# Altium schematic sheet CAN_ESP.SchDoc
size A3; Revision: 7
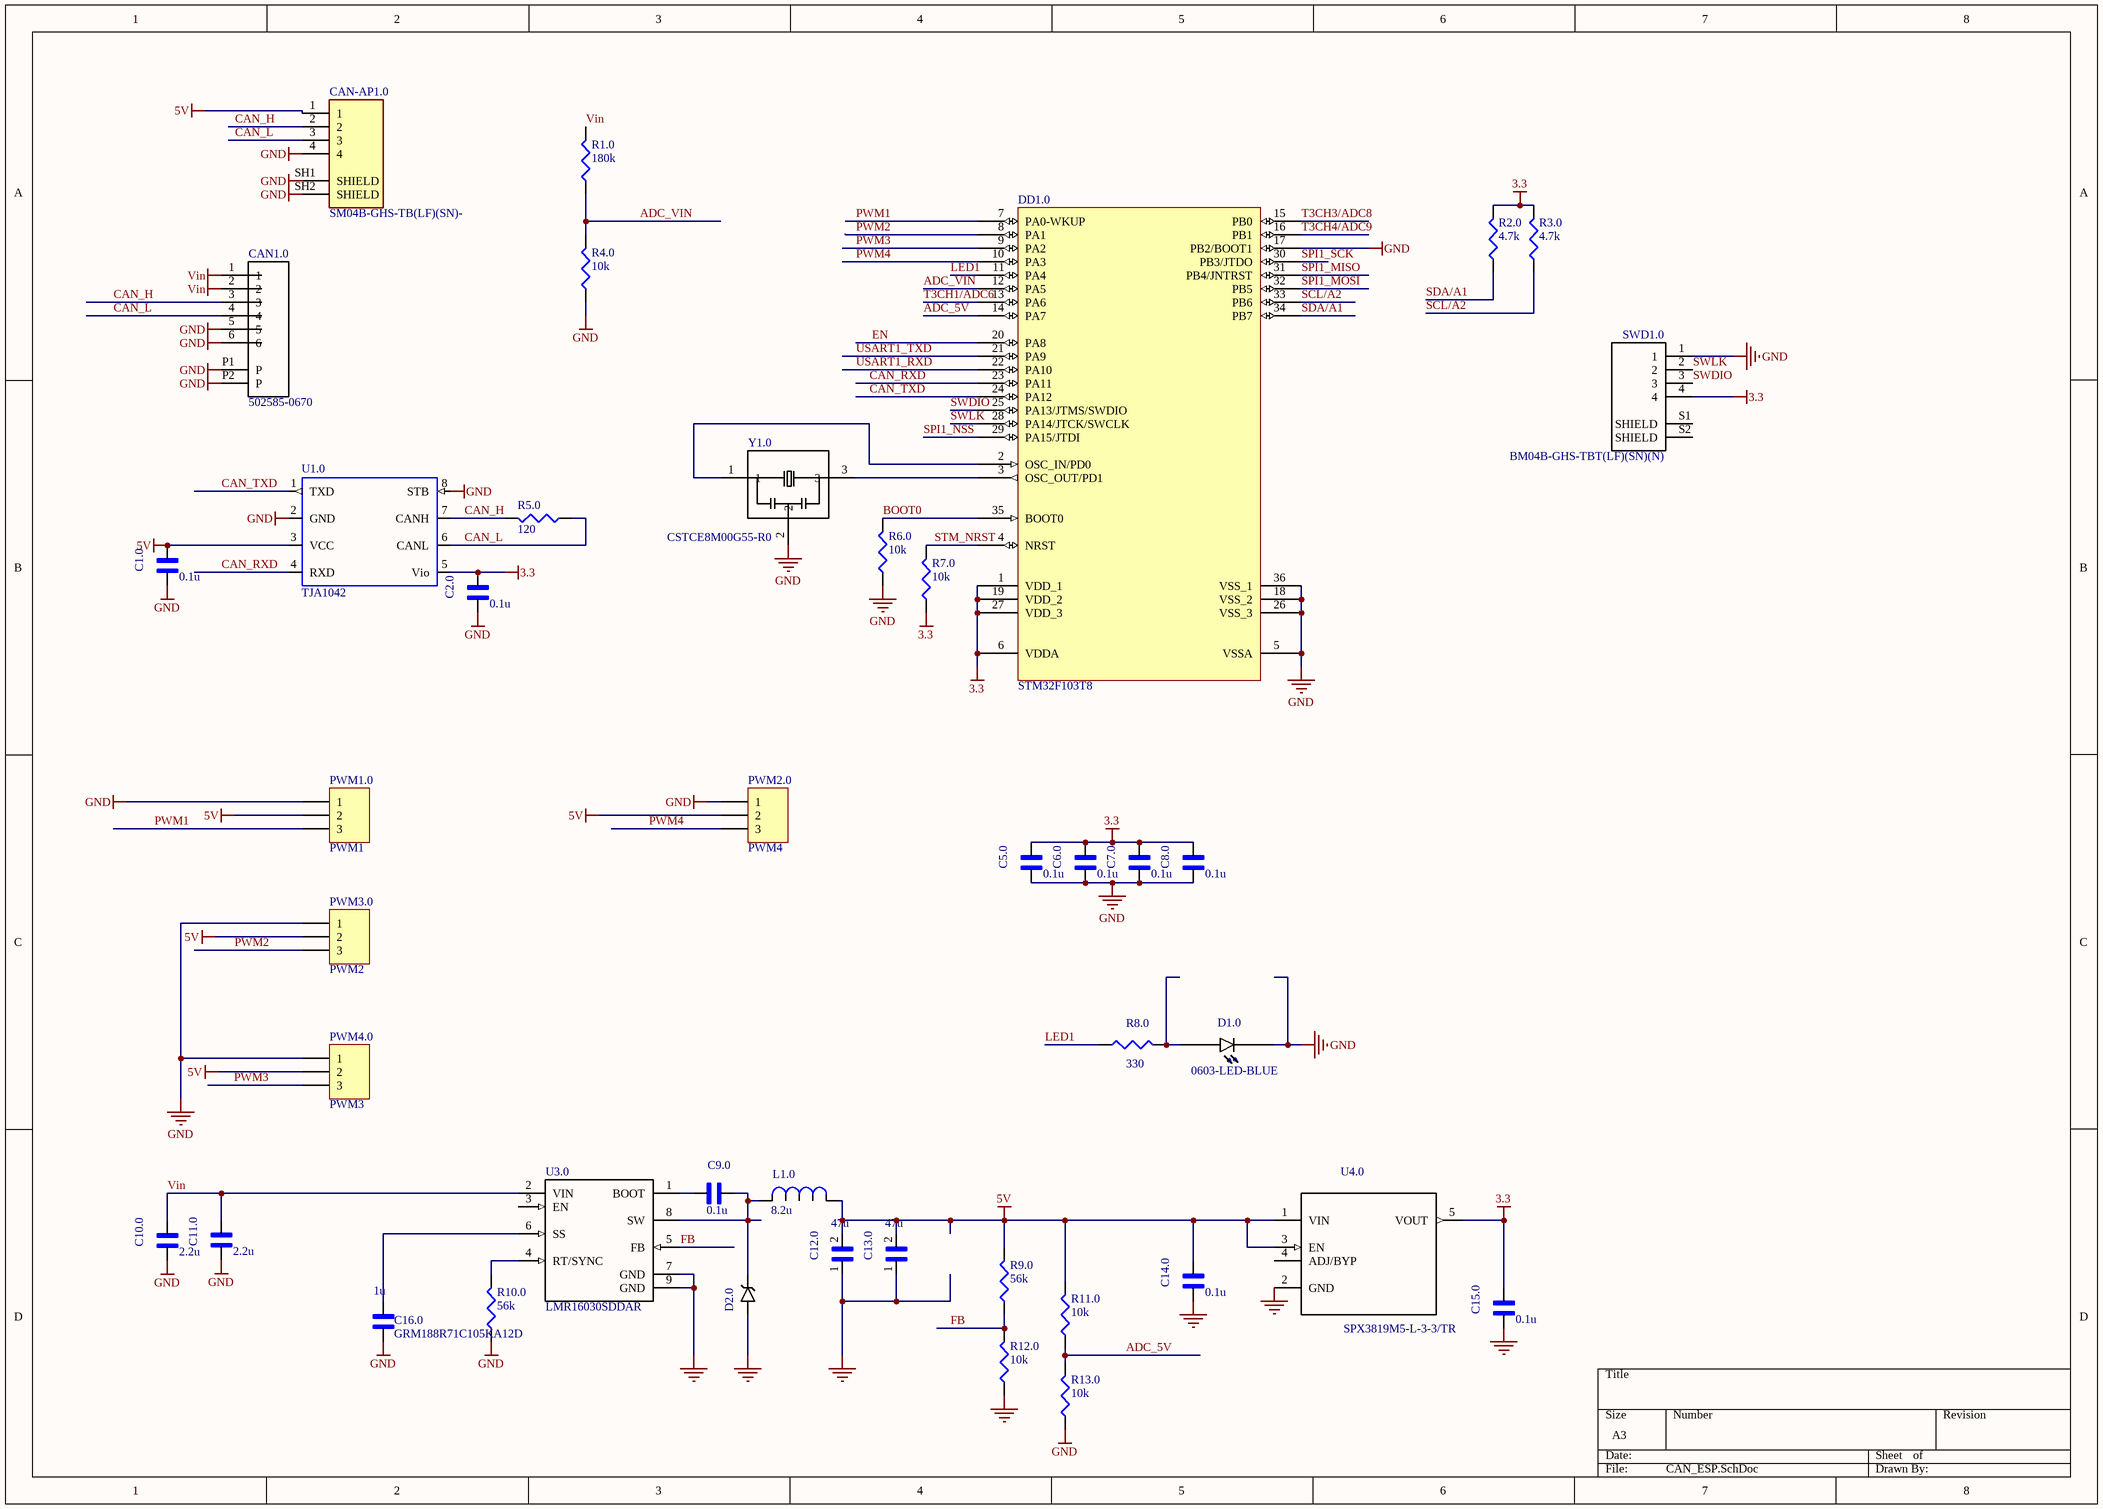
[diagram p0: CAN_ESP.SchDoc]

## Parts
C1.0  value 0.1u  [*CAPC1608X90]  (hidden comment: GX035C104MAT2-500)
C2.0  value 0.1u  [*CAPC1608X90]  (hidden comment: GX035C104MAT2-500)
C5.0  value 0.1u  [*CAPC1608X90]  (hidden comment: GX035C104MAT2-500)
C6.0  value 0.1u  [*CAPC1608X90]  (hidden comment: GX035C104MAT2-500)
C7.0  value 0.1u  [*CAPC1608X90]  (hidden comment: GX035C104MAT2-500)
C8.0  value 0.1u  [*CAPC1608X90]  (hidden comment: GX035C104MAT2-500)
C9.0  value 0.1u  [*CAPC1608X90]  (hidden comment: GX035C104MAT2-500)
C10.0  value 2.2u  [*CAP3216X125N]  (hidden comment: GRM31CR71H225KA88L)
C11.0  value 2.2u  [*CAP3216X125N]  (hidden comment: GRM31CR71H225KA88L)
C12.0  value 47u  [*CAPC3216X125N]  (hidden comment: GRM31CR61A476KE15L)
C13.0  value 47u  [*CAPC3216X125N]  (hidden comment: GRM31CR61A476KE15L)
C14.0  value 0.1u  [*CAPC1608X90]  (hidden comment: GX035C104MAT2-500)
C15.0  value 0.1u  [*CAPC1608X90]  (hidden comment: GX035C104MAT2-500)
C16.0  GRM188R71C105KA12D  value 1u  [CAPC1608X90N]
CAN1.0  502585-0670  [MOLEX_502585-0670]
CAN-AP1.0  SM04B-GHS-TB(LF)(SN)-  [JST_SM04B-GHS-TB(LF)(SN)-]
D1.0  0603-LED-BLUE  [*LEDM1608X80_LTE-C1906R-14(Primary)]
D2.0  SK56  [*SMB_P6SMB62AT3G(Primary)]  (value not drawn)
DD1.0  STM32F103T8  [*QFN50P600X600X100-37N]
L1.0  value 8.2u  [*IND_IHLP_2525_CZ]  (hidden comment: IHLP2525CZER8R2M01)
PWM1.0  PWM1  [HDR Side 3 pin]
PWM2.0  PWM4  [HDR Side 3 pin]
PWM3.0  PWM2  [HDR Side 3 pin]
PWM4.0  PWM3  [HDR Side 3 pin]
R1.0  value 180k  [J1-0603]  (hidden comment: Res3)
R2.0  value 4.7k  [J1-0603]  (hidden comment: Res3)
R3.0  value 4.7k  [J1-0603]  (hidden comment: Res3)
R4.0  value 10k  [J1-0603]  (hidden comment: Res3)
R5.0  value 120  [J1-0603]  (hidden comment: Res3)
R6.0  value 10k  [J1-0603]  (hidden comment: RC0603FR-0710KL)
R7.0  value 10k  [J1-0603]  (hidden comment: RC0603FR-0710KL)
R8.0  value 330  [J1-0603]  (hidden comment: Res3)
R9.0  value 56k  [J1-0603]  (hidden comment: Res3)
R10.0  value 56k  [J1-0603]  (hidden comment: Res3)
R11.0  value 10k  [J1-0603]  (hidden comment: RC0603FR-0710KL)
R12.0  value 10k  [J1-0603]  (hidden comment: RC0603FR-0710KL)
R13.0  value 10k  [J1-0603]  (hidden comment: RC0603FR-0710KL)
SWD1.0  BM04B-GHS-TBT(LF)(SN)(N)  [JST_BM04B-GHS-holes]
U1.0  TJA1042  [SOT782-1]
U3.0  LMR16030SDDAR  [*SOIC127P600X170-9N - duplicate]
U4.0  SPX3819M5-L-3-3/TR  [*SOT95P280X145-5N]
Y1.0  CSTCE8M00G55-R0  [*OSC_CSTCE8M00G55-R0]

## Nets
3.3: C2.0.1 C5.0.1 C6.0.1 C7.0.1 C8.0.1 C15.0.1 DD1.0.1(VDD_1) DD1.0.6(VDDA) DD1.0.19(VDD_2) DD1.0.27(VDD_3) R2.0.2 R3.0.2 R7.0.1 SWD1.0.4 U1.0.5(Vio) U4.0.5(VOUT)
5V: C1.0.1 C12.0.2 C13.0.2 C14.0.1 CAN-AP1.0.1 L1.0.1 PWM1.0.2 PWM2.0.2 PWM3.0.2 PWM4.0.2 R9.0.2 R11.0.2 U1.0.3(VCC) U4.0.1(VIN) U4.0.3(EN)
GND: C1.0.2 C2.0.2 C5.0.2 C6.0.2 C7.0.2 C8.0.2 C10.0.2 C11.0.2 C12.0.1 C13.0.1 C14.0.2 C15.0.2 C16.0.1 CAN1.0.5 CAN1.0.6 CAN1.0.P1(P) CAN1.0.P2(P) CAN-AP1.0.4 CAN-AP1.0.SH1(SHIELD) CAN-AP1.0.SH2(SHIELD) D1.0.C D2.0.A DD1.0.5(VSSA) DD1.0.17(PB2/BOOT1) DD1.0.18(VSS_2) DD1.0.26(VSS_3) DD1.0.36(VSS_1) PWM1.0.1 PWM2.0.1 PWM3.0.1 PWM4.0.1 R4.0.1 R6.0.1 R10.0.1 R12.0.1 R13.0.1 SWD1.0.1 U1.0.2(GND) U1.0.8(STB) U3.0.7(GND) U3.0.9(GND) U4.0.2(GND) Y1.0.2
Vin: C10.0.1 C11.0.1 CAN1.0.1 CAN1.0.2 R1.0.2 U3.0.2(VIN)
ADC_5V: DD1.0.14(PA7) R11.0.1 R13.0.2
ADC_VIN: DD1.0.12(PA5) R1.0.1 R4.0.2
BOOT0: DD1.0.35(BOOT0) R6.0.2
CAN_H: CAN1.0.3 CAN-AP1.0.2 R5.0.2 U1.0.7(CANH)
CAN_L: CAN1.0.4 CAN-AP1.0.3 R5.0.1 U1.0.6(CANL)
CAN_RXD: DD1.0.23(PA11) U1.0.4(RXD)
CAN_TXD: DD1.0.24(PA12) U1.0.1(TXD)
EN: DD1.0.20(PA8)
FB: R9.0.1 R12.0.2 U3.0.5(FB)
LED1: DD1.0.11(PA4) R8.0.1
PWM1: DD1.0.7(PA0-WKUP) PWM1.0.3
PWM2: DD1.0.8(PA1) PWM3.0.3
PWM3: DD1.0.9(PA2) PWM4.0.3
PWM4: DD1.0.10(PA3) PWM2.0.3
SCL/A2: DD1.0.33(PB6) R3.0.1
SDA/A1: DD1.0.34(PB7) R2.0.1
SPI1_MISO: DD1.0.31(PB4/JNTRST)
SPI1_MOSI: DD1.0.32(PB5)
SPI1_NSS: DD1.0.29(PA15/JTDI)
SPI1_SCK: DD1.0.30(PB3/JTDO)
STM_NRST: DD1.0.4(NRST) R7.0.2
SWDIO: DD1.0.25(PA13/JTMS/SWDIO) SWD1.0.3
SWLK: DD1.0.28(PA14/JTCK/SWCLK) SWD1.0.2
T3CH1/ADC6: DD1.0.13(PA6)
T3CH3/ADC8: DD1.0.15(PB0)
T3CH4/ADC9: DD1.0.16(PB1)
USART1_RXD: DD1.0.22(PA10)
USART1_TXD: DD1.0.21(PA9)
NetC9.0_1: C9.0.1 D2.0.C L1.0.2 U3.0.8(SW)
NetC9.0_2: C9.0.2 U3.0.1(BOOT)
NetC16.0_2: C16.0.2 U3.0.6(SS)
NetD1.0_A: D1.0.A R8.0.2
NetDD1.0_2: DD1.0.2(OSC_IN/PD0) Y1.0.1
NetDD1.0_3: DD1.0.3(OSC_OUT/PD1) Y1.0.3
NetR10.0_2: R10.0.2 U3.0.4(RT/SYNC)

Not connected (* = marked no-connect by the designer): SWD1.0 S1(SHIELD) S2(SHIELD); U3.0 3(EN); U4.0 4(ADJ/BYP)

## Library data of the parts
C1.0 C2.0 C5.0 C6.0 C7.0 C8.0 C9.0 = GX035C104MAT2-500: Cap Thin Film 0.1uf 50v 0603; MF: AVX; MP: GX035C104MAT2-500 or CL10B104JB8NNNC; Pacage Metric: 1608; Type: SMD; Package: 0603 AVX; SnapEDA_Link: https://www.snapeda.com/parts/GX035C104MAT2-500/AVX/view-part/?ref=snap
C10.0 C11.0 = GRM31CR71H225KA88L: / 1206 2.2 uF 50 V В±10% Tolerance X7R SMT Multilayer Ceramic Capacitor /; MF: Murata Electronics; Type: SMD; Package: 1206 Murata; SnapEDA_Link: https://www.snapeda.com/parts/GRM31CR71H225KA88L/Murata%20Electronics%20North%20America/view-part/?ref=snap; MP: GRM31CR71H225KA88L
C12.0 C13.0 = GRM31CR61A476KE15L: Multilayer Ceramic Capacitor, GRM Series, 47 - F, - 10%, X5R, 10 V, 1206 [3216 Metric]; MF: Murata Electronics; Type: SMD; Package: 1206 Murata Electronics; MP: GRM31CR61A476KE15L; SnapEDA_Link: https://www.snapeda.com/parts/GRM31CR61A476KE15L/Murata%20Electronics%20North%20America/view-part/?ref=snap
C14.0 C15.0 = GX035C104MAT2-500: Cap Thin Film 0.1uf 50v 0603; MF: AVX; Pacage Metric: 1608; Type: SMD; Package: 0603 AVX; MP: GX035C104MAT2-500; SnapEDA_Link: https://www.snapeda.com/parts/GX035C104MAT2-500/AVX/view-part/?ref=snap
C16.0 = GRM188R71C105KA12D: SMD Capacitor X7R(EIA) with Capacitance: 1.0uF Tol. 10%. Rated Voltage: 16Vdc; MF: Murata Electronics; Pacage Metric: 1608; MP: GRM188R71C105KA12D; SnapEDA_Link: https://www.snapeda.com/parts/GRM188R71C105KA12D/Murata%20Electronics%20North%20America/view-part/228340/?ref=snap; Package: 0603; ChipDip_Link: https://www.chipdip.ru/product/grm188r71c105ka12d; HelpURL: https://static.chipdip.ru/lib/428/DOC005428493.pdf; Type: SMD
CAN1.0 = 502585-0670: 1.50mm Pitch, CLIK-Mate PCB Receptacle, Single Row, Surface Mount, Right-Angle, Tin Plating, Positive Lock, 6 Circuits, Natural; MF: Molex; System: Connector; MP: 502585-0670; Package: None; SnapEDA_Link: https://www.snapeda.com/parts/502494-0670/Molex/view-part/?ref=snap; Value: *; Type: SMD
CAN-AP1.0 = SM04B-GHS-TB(LF)(SN)-: Connector Header Surface Mount, Right Angle 4 position 0.049 _1.25mm_; MF: JST Sales; MP: SM04B-GHS-TB(LF)(SN); Package: None; Value: *; SnapEDA_Link: https://www.snapeda.com/parts/SM04B-GHS-TB%28LF%29%28SN%29-/JST%20Sales%20America%20Inc./view-part/2759740/?ref=snap; HelpURL: http://www.farnell.com/datasheets/2082975.pdf; System: Connector; ChipDip_Link: https://www.chipdip.ru/product/sm04b-ghs-tb-lf-sn-gh-1.25mm-header-side-ent
D1.0 = LTE-C1906R-14: LED IrLED Chip LED 2-Pin SMD T/R; Package: 0603 Lite-On; MP: 0603-LED-BLUE; SnapEDA_Link: https://www.snapeda.com/parts/LTE-C1906R-14/Lite-On%20Inc./view-part/?ref=snap; Value: *; Type: SMD
D2.0 = SK56: Диод Шоттки 5А 60В [SMB / DO-214AA]; MF: Littelfuse Inc.; Type: SMD; MP: SK56; Package: DO-214 Littelfuse; SnapEDA_Link: https://www.snapeda.com/parts/P6SMB62AT3G/Littelfuse%20Inc./view-part/?ref=snap; Value: *; ChipDip_Link: https://www.chipdip.ru/product/sk56
DD1.0 = STM32F103T8: STM32F103T8U6, Микроконтроллер 32BIT ARM 64K FLASH [VFQFPN-36]; MF: STM; ChipDip_Link: https://www.chipdip.ru/product/stm32f103t8u6-2; HelpURL: http://www.st.com/stonline/products/literature/ds/13587.pdf; MP: STM32F103T8U6; Package: VFQFPN-36; SnapEDA_Link: https://www.snapeda.com/parts/STM32F103T8U6TR/STMicroelectronics/view-part/?ref=search&t=STM32F103T8U6; Type: SMD
L1.0 = IHLP2525CZER8R2M01: IHLP2525CZER8R2M01, 8.2uH 4A 20% Low Profile High Current SMT Inductor, Индуктивность; MF: Vishay Dale; Price: None; Availability: Unavailable; SnapEDA_Link: https://www.snapeda.com/parts/IHLP2525CZER100M01/Vishay%20Dale/view-part/?ref=snap; MP: IHLP2525CZER8R2M01; Package: Nonstandard Vishay
PWM1.0 PWM2.0 PWM3.0 PWM4.0 = Header 3: Header, 4-Pin; System: Connector; MF: Connfly electronic (Zhenqin); MP: PLS-3 (DS1021-1x3); Type: SMD; ChipDip_Link: https://www.chipdip.ru/product/pls-3; HelpURL: https://static.chipdip.ru/lib/227/DOC000227157.pdf
R1.0 = Res3: Resistor; Pacage Metric: 1608; MP: 180K 1% 0603; Package: R0603; Type: SMD
R2.0 R3.0 = Res3: Resistor; Pacage Metric: 1608; MP: 4.7K 1% 0603; ChipDip_Link: https://www.chipdip.ru/product0/9000079736; HelpURL: https://www.chipdip.ru/product0/9000079736; Package: R0603; Type: SMD
R4.0 = Res3: Resistor; Pacage Metric: 1608; MP: 10K 1% 0603; ChipDip_Link: https://www.chipdip.ru/product0/9000079736; HelpURL: https://www.chipdip.ru/product0/9000079736; Package: R0603; Type: SMD
R5.0 = Res3: 120 Ohms 1 0.1 W 1 10 W Chip Resistor 0603 1608 Metric Thick Film; Pacage Metric: 1608; MP: RC0603FR-07120RL; ChipDip_Link: https://www.chipdip.ru/product0/9000079618; HelpURL: https://www.chipdip.ru/product0/9000079618; Package: R0603; Type: SMD
R6.0 R7.0 R11.0 R12.0 R13.0 = RC0603FR-0710KL: 10 kOhms 1 0.1 W 1 10 W Chip Resistor 0603 1608 Metric Thick Film; Pacage Metric: 1608; MF: Yageo or NXP; MP: 10K 1% 0603; ChipDip_Link: https://www.chipdip.ru/product0/9000079736; HelpURL: https://www.chipdip.ru/product0/9000079736; Package: R0603; Type: SMD; SnapEDA_Link: https://www.snapeda.com/parts/RC0603FR-0710KL/Yageo/view-part/?ref=dk&t=RC0603FR-0710KL&con_ref=None
R8.0 = Res3: Resistor; Pacage Metric: 1608; MP: RC0603FR-07330RL; ChipDip_Link: https://www.chipdip.ru/product0/9000079628; HelpURL: https://www.chipdip.ru/product0/9000079628; Package: R0603; Type: SMD
R9.0 R10.0 = Res3: Resistor; Pacage Metric: 1608; MP: RC0603FR-0756KL; ChipDip_Link: https://www.chipdip.ru/product0/9000079754; HelpURL: https://www.chipdip.ru/product0/9000079754; Package: R0603; Type: SMD
SWD1.0 = BM04B-GHS-TBT(LF)(SN)(N): Conn Shrouded Header HDR 4 POS 1.25mm Solder ST SMD Reel; MF: JST Sales; MP: SM04B-GHS-TB(LF)(SN); Instructions: Do not install; System: Connector; SnapEDA_Link: https://www.snapeda.com/parts/BM04B-GHS-TBT%28LF%29%28SN%29%28N%29/JST%20Sales%20America%20Inc./view-part/?ref=snap; Package: None; Value: *; Type: SMD
U1.0 = TJA1042: 1/1 Transceiver Half CANbus 8-SO; MF: NXP USA; SnapEDA_Link: https://www.snapeda.com/parts/TJA1042/NXP%20USA%20Inc./view-part/900919/?ref=snap; Value: *; MP: TJA1042; Package: VDFN-8 NXP USA; ChipDip_Link: https://www.chipdip.ru/product1/8002840332; HelpURL: https://static.chipdip.ru/lib/583/DOC001583059.pdf; Type: SMD
U3.0 = LMR16030SDDAR: LMR16030SDDAR, Conv DC-DC 4.3V to 60V Step Down Single-Out 1V to 50V 3A Automotive 8-Pin HSOP EP T/R; MF: Texas Instruments; SnapEDA_Link: https://www.snapeda.com/parts/TPS54560DDA/Texas%20Instruments/view-part/?ref=snap; MP: LMR16030SDDAR; Package: PowerSOIC-8 Texas Instruments; Value: *; Type: SMD; ChipDip_Link: https://www.chipdip.ru/product1/8003448566; HelpURL: https://www.ti.com/lit/ds/symlink/lmr16030.pdf
U4.0 = SPX3819M5-L: Low Dropout Voltage Regulator, Adjustable 0.5A, В±1%, 2.5 to 16 Vin, 5-Pin SOT-23 /; MF: MaxLinear, Inc.; Value: 3V3; MP: SPX3819M5-L-3-3/TR; Package: SOT-23-5 Exar; SnapEDA_Link: https://www.snapeda.com/parts/SPX3819M5-L/MaxLinear%2C%20Inc./view-part/?ref=snap; Type: SMD; ChipDip_Link: https://www.chipdip.ru/product1/8003455237; HelpURL: http://www.farnell.com/datasheets/2614478.pdf
Y1.0 = CSTCE8M00G55-R0: Ceramic Resonator 8MHz ??0.5% _Tol_ ??0.2% _Stability_ 33pF 40Ohm 3-Pin CSMD T/R; MF: Murata; MP: CSTCE8M00G55-R0; Package: SMD-3 Murata; SnapEDA_Link: https://www.snapeda.com/parts/CSTCE8M00G55-R0/Murata%20Electronics%20North%20America/view-part/?ref=snap; Value: *; ChipDip_Link: https://www.chipdip.ru/product1/8001783721; HelpURL: https://www.murata.com/en-eu/api/pdfdownloadapi?cate=&partno=CSTCE8M00G55-R0; Type: SMD